# Altium project AMC_FMC_Carrier v4.PrjPcb (part 7 of 18)

## Sheet SDRAM.SchDoc: AMC FMC Carrier v4
size 420 x 297 mm; CompanyName: WUT; Organization: WUT ISE; Address1: Warsaw Univeristy of Technology; Address2: Nowowiejska 15/19 00-665 Warsaw; Address3: t.przywozki@gmail.com; Revision: 1; SheetNumber: 17; SheetTotal: 29; Project: AMC FMC Carrier v4; ModifiedBy: -; CheckedDate: -; Title2: DDR3 32bit; DivGrp: ISE; Designer: T. Przywozki; ModifiedDate: -; ProjectName: ADC/DAC MEZZANINE
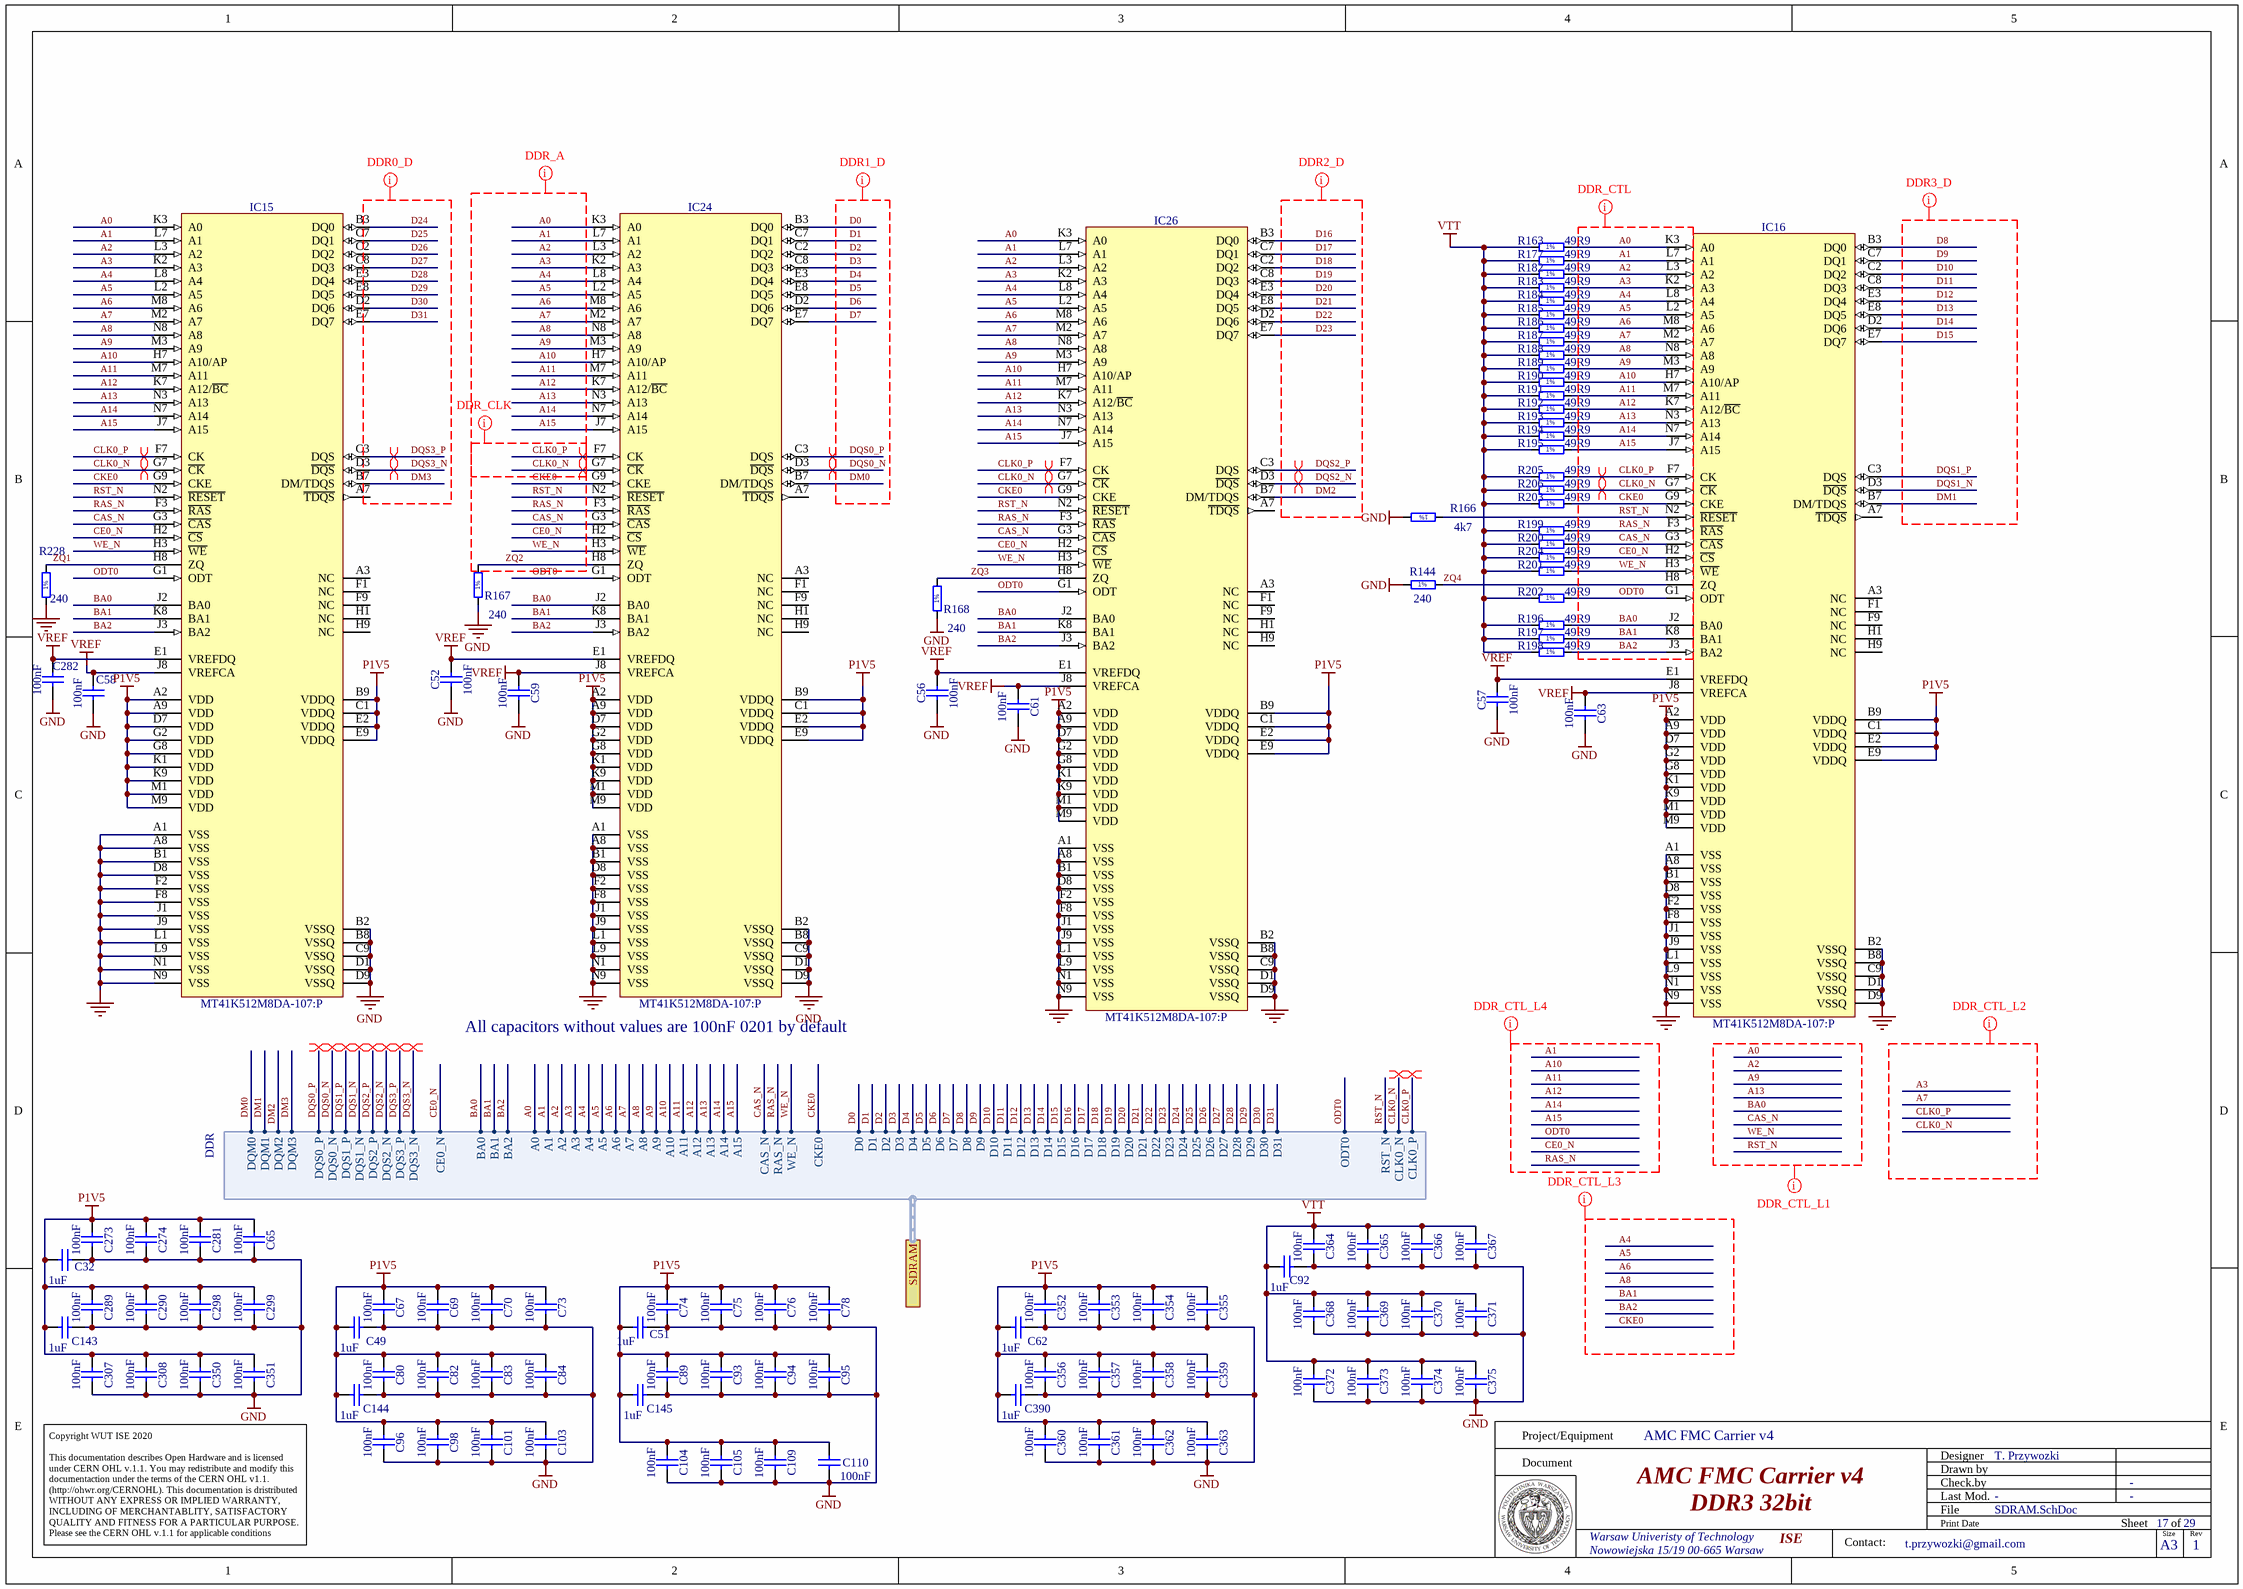
[diagram p12: SDRAM.SchDoc]

### Parts
C32  1uF  [CAPC1608X87N]
C49  1uF  [CAPC1608X87N]
C51  1uF  [CAPC1608X87N]
C52  100nF  [CAPC0603X33N]
C56  100nF  [CAPC0603X33N]
C57  100nF  [CAPC0603X33N]
C58  100nF  [CAPC0603X33N]
C59  100nF  [CAPC0603X33N]
C61  100nF  [CAPC0603X33N]
C62  1uF  [CAPC1608X87N]
C63  100nF  [CAPC0603X33N]
C65  100nF  [CAPC0603X33N]
C67  100nF  [CAPC0603X33N]
C69  100nF  [CAPC0603X33N]
C70  100nF  [CAPC0603X33N]
C73  100nF  [CAPC0603X33N]
C74  100nF  [CAPC0603X33N]
C75  100nF  [CAPC0603X33N]
C76  100nF  [CAPC0603X33N]
C78  100nF  [CAPC0603X33N]
C80  100nF  [CAPC0603X33N]
C82  100nF  [CAPC0603X33N]
C83  100nF  [CAPC0603X33N]
C84  100nF  [CAPC0603X33N]
C89  100nF  [CAPC0603X33N]
C92  1uF  [CAPC1608X87N]
C93  100nF  [CAPC0603X33N]
C94  100nF  [CAPC0603X33N]
C95  100nF  [CAPC0603X33N]
C96  100nF  [CAPC0603X33N]
C98  100nF  [CAPC0603X33N]
C101  100nF  [CAPC0603X33N]
C103  100nF  [CAPC0603X33N]
C104  100nF  [CAPC0603X33N]
C105  100nF  [CAPC0603X33N]
C109  100nF  [CAPC0603X33N]
C110  100nF  [CAPC0603X33N]
C143  1uF  [CAPC1608X87N]
C144  1uF  [CAPC1608X87N]
C145  1uF  [CAPC1608X87N]
C273  100nF  [CAPC0603X33N]
C274  100nF  [CAPC0603X33N]
C281  100nF  [CAPC0603X33N]
C282  100nF  [CAPC0603X33N]
C289  100nF  [CAPC0603X33N]
C290  100nF  [CAPC0603X33N]
C298  100nF  [CAPC0603X33N]
C299  100nF  [CAPC0603X33N]
C307  100nF  [CAPC0603X33N]
C308  100nF  [CAPC0603X33N]
C350  100nF  [CAPC0603X33N]
C351  100nF  [CAPC0603X33N]
C352  100nF  [CAPC0603X33N]
C353  100nF  [CAPC0603X33N]
C354  100nF  [CAPC0603X33N]
C355  100nF  [CAPC0603X33N]
C356  100nF  [CAPC0603X33N]
C357  100nF  [CAPC0603X33N]
C358  100nF  [CAPC0603X33N]
C359  100nF  [CAPC0603X33N]
C360  100nF  [CAPC0603X33N]
C361  100nF  [CAPC0603X33N]
C362  100nF  [CAPC0603X33N]
C363  100nF  [CAPC0603X33N]
C364  100nF  [CAPC0603X33N]
C365  100nF  [CAPC0603X33N]
C366  100nF  [CAPC0603X33N]
C367  100nF  [CAPC0603X33N]
C368  100nF  [CAPC0603X33N]
C369  100nF  [CAPC0603X33N]
C370  100nF  [CAPC0603X33N]
C371  100nF  [CAPC0603X33N]
C372  100nF  [CAPC0603X33N]
C373  100nF  [CAPC0603X33N]
C374  100nF  [CAPC0603X33N]
C375  100nF  [CAPC0603X33N]
C390  1uF  [CAPC1608X87N]
IC15  MT41K512M8DA-107:P  [BGA78C80P9X13_800X1050X120]
IC16  MT41K512M8DA-107:P  [BGA78C80P9X13_800X1050X120]
IC24  MT41K512M8DA-107:P  [BGA78C80P9X13_800X1050X120]
IC26  MT41K512M8DA-107:P  [BGA78C80P9X13_800X1050X120]
R144  240  [RESC1005X40N]
R163  49R9  [RESC1005X40N]
R166  4k7  [RESC1005X40N]
R167  240  [RESC1005X40N]
R168  240  [RESC1005X40N]
R177  49R9  [RESC1005X40N]
R182  49R9  [RESC1005X40N]
R183  49R9  [RESC1005X40N]
R184  49R9  [RESC1005X40N]
R185  49R9  [RESC1005X40N]
R186  49R9  [RESC1005X40N]
R187  49R9  [RESC1005X40N]
R188  49R9  [RESC1005X40N]
R189  49R9  [RESC1005X40N]
R190  49R9  [RESC1005X40N]
R191  49R9  [RESC1005X40N]
R192  49R9  [RESC1005X40N]
R193  49R9  [RESC1005X40N]
R194  49R9  [RESC1005X40N]
R195  49R9  [RESC1005X40N]
R196  49R9  [RESC1005X40N]
R197  49R9  [RESC1005X40N]
R198  49R9  [RESC1005X40N]
R199  49R9  [RESC1005X40N]
R200  49R9  [RESC1005X40N]
R201  49R9  [RESC1005X40N]
R202  49R9  [RESC1005X40N]
R203  49R9  [RESC1005X40N]
R204  49R9  [RESC1005X40N]
R205  49R9  [RESC1005X40N]
R206  49R9  [RESC1005X40N]
R228  240  [RESC1005X40N]

### Ports
SDRAM (harness DDR)

### Harnesses
DDR: CKE0, A0, A1, A2, A3, A4, A5, A7, A8, A9, A10, A11, A12, A13, BA0, BA1, BA2, A14, A15, CAS_N, RAS_N, WE_N, CE0_N, DQM0, DQM1, A6, D0, D1, D2, D3, D4, D5, D6, D7, D8, D9, D10, D11, D12, D13, D14, D15, CLK0_N, CLK0_P, ODT0, RST_N, D16, D17, D18, D19, D20, D21, D22, D23, D24, D25, D26, D27, D28, D29, D30, D31, DQS0_P, DQS1_P, DQS0_N, DQS1_N, DQS3_N, DQS3_P, DQS2_P, DQS2_N, DQM2, DQM3

### Nets
GND: C32.2 C49.2 C51.2 C52.2 C56.2 C57.2 C58.2 C59.2 C61.2 C62.2 C63.2 C65.2 C67.2 C69.2 C70.2 C73.2 C74.2 C75.2 C76.2 C78.2 C80.2 C82.2 C83.2 C84.2 C89.2 C92.2 C93.2 C94.2 C95.2 C96.2 C98.2 C101.2 C103.2 C104.2 C105.2 C109.2 C110.1 C143.2 C144.2 C145.2 C273.2 C274.2 C281.2 C282.1 C289.2 C290.2 C298.2 C299.2 C307.2 C308.2 C350.2 C351.2 C352.2 C353.2 C354.2 C355.2 C356.2 C357.2 C358.2 C359.2 C360.2 C361.2 C362.2 C363.2 C364.2 C365.2 C366.2 C367.2 C368.2 C369.2 C370.2 C371.2 C372.2 C373.2 C374.2 C375.2 C390.2 IC15.A1(VSS) IC15.A8(VSS) IC15.B1(VSS) IC15.B2(VSSQ) IC15.B8(VSSQ) IC15.C9(VSSQ) IC15.D1(VSSQ) IC15.D8(VSS) IC15.D9(VSSQ) IC15.F2(VSS) IC15.F8(VSS) IC15.J1(VSS) IC15.J9(VSS) IC15.L1(VSS) IC15.L9(VSS) IC15.N1(VSS) IC15.N9(VSS) IC16.A1(VSS) IC16.A8(VSS) IC16.B1(VSS) IC16.B2(VSSQ) IC16.B8(VSSQ) IC16.C9(VSSQ) IC16.D1(VSSQ) IC16.D8(VSS) IC16.D9(VSSQ) IC16.F2(VSS) IC16.F8(VSS) IC16.J1(VSS) IC16.J9(VSS) IC16.L1(VSS) IC16.L9(VSS) IC16.N1(VSS) IC16.N9(VSS) IC24.A1(VSS) IC24.A8(VSS) IC24.B1(VSS) IC24.B2(VSSQ) IC24.B8(VSSQ) IC24.C9(VSSQ) IC24.D1(VSSQ) IC24.D8(VSS) IC24.D9(VSSQ) IC24.F2(VSS) IC24.F8(VSS) IC24.J1(VSS) IC24.J9(VSS) IC24.L1(VSS) IC24.L9(VSS) IC24.N1(VSS) IC24.N9(VSS) IC26.A1(VSS) IC26.A8(VSS) IC26.B1(VSS) IC26.B2(VSSQ) IC26.B8(VSSQ) IC26.C9(VSSQ) IC26.D1(VSSQ) IC26.D8(VSS) IC26.D9(VSSQ) IC26.F2(VSS) IC26.F8(VSS) IC26.J1(VSS) IC26.J9(VSS) IC26.L1(VSS) IC26.L9(VSS) IC26.N1(VSS) IC26.N9(VSS) R144.1 R166.2 R167.1 R168.1 R228.1
P1V5: C32.1 C49.1 C51.1 C62.1 C65.1 C67.1 C69.1 C70.1 C73.1 C74.1 C75.1 C76.1 C78.1 C80.1 C82.1 C83.1 C84.1 C89.1 C93.1 C94.1 C95.1 C96.1 C98.1 C101.1 C103.1 C104.1 C105.1 C109.1 C110.2 C143.1 C144.1 C145.1 C273.1 C274.1 C281.1 C289.1 C290.1 C298.1 C299.1 C307.1 C308.1 C350.1 C351.1 C352.1 C353.1 C354.1 C355.1 C356.1 C357.1 C358.1 C359.1 C360.1 C361.1 C362.1 C363.1 C390.1 IC15.A2(VDD) IC15.A9(VDD) IC15.B9(VDDQ) IC15.C1(VDDQ) IC15.D7(VDD) IC15.E2(VDDQ) IC15.E9(VDDQ) IC15.G2(VDD) IC15.G8(VDD) IC15.K1(VDD) IC15.K9(VDD) IC15.M1(VDD) IC15.M9(VDD) IC16.A2(VDD) IC16.A9(VDD) IC16.B9(VDDQ) IC16.C1(VDDQ) IC16.D7(VDD) IC16.E2(VDDQ) IC16.E9(VDDQ) IC16.G2(VDD) IC16.G8(VDD) IC16.K1(VDD) IC16.K9(VDD) IC16.M1(VDD) IC16.M9(VDD) IC24.A2(VDD) IC24.A9(VDD) IC24.B9(VDDQ) IC24.C1(VDDQ) IC24.D7(VDD) IC24.E2(VDDQ) IC24.E9(VDDQ) IC24.G2(VDD) IC24.G8(VDD) IC24.K1(VDD) IC24.K9(VDD) IC24.M1(VDD) IC24.M9(VDD) IC26.A2(VDD) IC26.A9(VDD) IC26.B9(VDDQ) IC26.C1(VDDQ) IC26.D7(VDD) IC26.E2(VDDQ) IC26.E9(VDDQ) IC26.G2(VDD) IC26.G8(VDD) IC26.K1(VDD) IC26.K9(VDD) IC26.M1(VDD) IC26.M9(VDD)
VREF: C52.1 C56.1 C57.1 C58.1 C59.1 C61.1 C63.1 C282.2 IC15.E1(VREFDQ) IC15.J8(VREFCA) IC16.E1(VREFDQ) IC16.J8(VREFCA) IC24.E1(VREFDQ) IC24.J8(VREFCA) IC26.E1(VREFDQ) IC26.J8(VREFCA)
VTT: C92.1 C364.1 C365.1 C366.1 C367.1 C368.1 C369.1 C370.1 C371.1 C372.1 C373.1 C374.1 C375.1 R163.1 R177.1 R182.1 R183.1 R184.1 R185.1 R186.1 R187.1 R188.1 R189.1 R190.1 R191.1 R192.1 R193.1 R194.1 R195.1 R196.1 R197.1 R198.1 R199.1 R200.1 R201.1 R202.1 R203.1 R204.1 R205.1 R206.1
A0: IC15.K3(A0) IC16.K3(A0) IC24.K3(A0) IC26.K3(A0) R163.2 ; port SDRAM.A0  [project net FDDR.A0]
A1: IC15.L7(A1) IC16.L7(A1) IC24.L7(A1) IC26.L7(A1) R177.2 ; port SDRAM.A1  [project net FDDR.A1]
A2: IC15.L3(A2) IC16.L3(A2) IC24.L3(A2) IC26.L3(A2) R182.2 ; port SDRAM.A2  [project net FDDR.A2]
A3: IC15.K2(A3) IC16.K2(A3) IC24.K2(A3) IC26.K2(A3) R183.2 ; port SDRAM.A3  [project net FDDR.A3]
A4: IC15.L8(A4) IC16.L8(A4) IC24.L8(A4) IC26.L8(A4) R184.2 ; port SDRAM.A4  [project net FDDR.A4]
A5: IC15.L2(A5) IC16.L2(A5) IC24.L2(A5) IC26.L2(A5) R185.2 ; port SDRAM.A5  [project net FDDR.A5]
A6: IC15.M8(A6) IC16.M8(A6) IC24.M8(A6) IC26.M8(A6) R186.2 ; port SDRAM.A6  [project net FDDR.A6]
A7: IC15.M2(A7) IC16.M2(A7) IC24.M2(A7) IC26.M2(A7) R187.2 ; port SDRAM.A7  [project net FDDR.A7]
A8: IC15.N8(A8) IC16.N8(A8) IC24.N8(A8) IC26.N8(A8) R188.2 ; port SDRAM.A8  [project net FDDR.A8]
A9: IC15.M3(A9) IC16.M3(A9) IC24.M3(A9) IC26.M3(A9) R189.2 ; port SDRAM.A9  [project net FDDR.A9]
A10: IC15.H7(A10/AP) IC16.H7(A10/AP) IC24.H7(A10/AP) IC26.H7(A10/AP) R190.2 ; port SDRAM.A10  [project net FDDR.A10]
A11: IC15.M7(A11) IC16.M7(A11) IC24.M7(A11) IC26.M7(A11) R191.2 ; port SDRAM.A11  [project net FDDR.A11]
A12: IC15.K7(A12/~{BC}) IC16.K7(A12/~{BC}) IC24.K7(A12/~{BC}) IC26.K7(A12/~{BC}) R192.2 ; port SDRAM.A12  [project net FDDR.A12]
A13: IC15.N3(A13) IC16.N3(A13) IC24.N3(A13) IC26.N3(A13) R193.2 ; port SDRAM.A13  [project net FDDR.A13]
A14: IC15.N7(A14) IC16.N7(A14) IC24.N7(A14) IC26.N7(A14) R194.2 ; port SDRAM.A14  [project net FDDR.A14]
A15: IC15.J7(A15) IC16.J7(A15) IC24.J7(A15) IC26.J7(A15) R195.2 ; port SDRAM.A15  [project net FDDR.A15]
BA0: IC15.J2(BA0) IC16.J2(BA0) IC24.J2(BA0) IC26.J2(BA0) R196.2 ; port SDRAM.BA0  [project net FDDR.BA0]
BA1: IC15.K8(BA1) IC16.K8(BA1) IC24.K8(BA1) IC26.K8(BA1) R197.2 ; port SDRAM.BA1  [project net FDDR.BA1]
BA2: IC15.J3(BA2) IC16.J3(BA2) IC24.J3(BA2) IC26.J3(BA2) R198.2 ; port SDRAM.BA2  [project net FDDR.BA2]
CAS_N: IC15.G3(~{CAS}) IC16.G3(~{CAS}) IC24.G3(~{CAS}) IC26.G3(~{CAS}) R200.2 ; port SDRAM.CAS_N  [project net FDDR.CAS_N]
CE0_N: IC15.H2(~{CS}) IC16.H2(~{CS}) IC24.H2(~{CS}) IC26.H2(~{CS}) R204.2 ; port SDRAM.CE0_N  [project net FDDR.CE0_N]
CKE0: IC15.G9(CKE) IC16.G9(CKE) IC24.G9(CKE) IC26.G9(CKE) R203.2 ; port SDRAM.CKE0  [project net FDDR.CKE0]
CLK0_N: IC15.G7(~{CK}) IC16.G7(~{CK}) IC24.G7(~{CK}) IC26.G7(~{CK}) R206.2 ; port SDRAM.CLK0_N  [project net FDDR.CLK0_N]
CLK0_P: IC15.F7(CK) IC16.F7(CK) IC24.F7(CK) IC26.F7(CK) R205.2 ; port SDRAM.CLK0_P  [project net FDDR.CLK0_P]
D0: IC24.B3(DQ0) ; port SDRAM.D0  [project net FDDR.D0]
D1: IC24.C7(DQ1) ; port SDRAM.D1  [project net FDDR.D1]
D2: IC24.C2(DQ2) ; port SDRAM.D2  [project net FDDR.D2]
D3: IC24.C8(DQ3) ; port SDRAM.D3  [project net FDDR.D3]
D4: IC24.E3(DQ4) ; port SDRAM.D4  [project net FDDR.D4]
D5: IC24.E8(DQ5) ; port SDRAM.D5  [project net FDDR.D5]
D6: IC24.D2(DQ6) ; port SDRAM.D6  [project net FDDR.D6]
D7: IC24.E7(DQ7) ; port SDRAM.D7  [project net FDDR.D7]
D8: IC16.B3(DQ0) ; port SDRAM.D8  [project net FDDR.D8]
D9: IC16.C7(DQ1) ; port SDRAM.D9  [project net FDDR.D9]
D10: IC16.C2(DQ2) ; port SDRAM.D10  [project net FDDR.D10]
D11: IC16.C8(DQ3) ; port SDRAM.D11  [project net FDDR.D11]
D12: IC16.E3(DQ4) ; port SDRAM.D12  [project net FDDR.D12]
D13: IC16.E8(DQ5) ; port SDRAM.D13  [project net FDDR.D13]
D14: IC16.D2(DQ6) ; port SDRAM.D14  [project net FDDR.D14]
D15: IC16.E7(DQ7) ; port SDRAM.D15  [project net FDDR.D15]
D16: IC26.B3(DQ0) ; port SDRAM.D16  [project net FDDR.D16]
D17: IC26.C7(DQ1) ; port SDRAM.D17  [project net FDDR.D17]
D18: IC26.C2(DQ2) ; port SDRAM.D18  [project net FDDR.D18]
D19: IC26.C8(DQ3) ; port SDRAM.D19  [project net FDDR.D19]
D20: IC26.E3(DQ4) ; port SDRAM.D20  [project net FDDR.D20]
D21: IC26.E8(DQ5) ; port SDRAM.D21  [project net FDDR.D21]
D22: IC26.D2(DQ6) ; port SDRAM.D22  [project net FDDR.D22]
D23: IC26.E7(DQ7) ; port SDRAM.D23  [project net FDDR.D23]
D24: IC15.B3(DQ0) ; port SDRAM.D24  [project net FDDR.D24]
D25: IC15.C7(DQ1) ; port SDRAM.D25  [project net FDDR.D25]
D26: IC15.C2(DQ2) ; port SDRAM.D26  [project net FDDR.D26]
D27: IC15.C8(DQ3) ; port SDRAM.D27  [project net FDDR.D27]
D28: IC15.E3(DQ4) ; port SDRAM.D28  [project net FDDR.D28]
D29: IC15.E8(DQ5) ; port SDRAM.D29  [project net FDDR.D29]
D30: IC15.D2(DQ6) ; port SDRAM.D30  [project net FDDR.D30]
D31: IC15.E7(DQ7) ; port SDRAM.D31  [project net FDDR.D31]
DM0: IC24.B7(DM/TDQS) ; port SDRAM.DQM0  [project net FDDR.DQM0]
DM1: IC16.B7(DM/TDQS) ; port SDRAM.DQM1  [project net FDDR.DQM1]
DM2: IC26.B7(DM/TDQS) ; port SDRAM.DQM2  [project net FDDR.DQM2]
DM3: IC15.B7(DM/TDQS) ; port SDRAM.DQM3  [project net FDDR.DQM3]
DQS0_N: IC24.D3(~{DQS}) ; port SDRAM.DQS0_N  [project net FDDR.DQS0_N]
DQS0_P: IC24.C3(DQS) ; port SDRAM.DQS0_P  [project net FDDR.DQS0_P]
DQS1_N: IC16.D3(~{DQS}) ; port SDRAM.DQS1_N  [project net FDDR.DQS1_N]
DQS1_P: IC16.C3(DQS) ; port SDRAM.DQS1_P  [project net FDDR.DQS1_P]
DQS2_N: IC26.D3(~{DQS}) ; port SDRAM.DQS2_N  [project net FDDR.DQS2_N]
DQS2_P: IC26.C3(DQS) ; port SDRAM.DQS2_P  [project net FDDR.DQS2_P]
DQS3_N: IC15.D3(~{DQS}) ; port SDRAM.DQS3_N  [project net FDDR.DQS3_N]
DQS3_P: IC15.C3(DQS) ; port SDRAM.DQS3_P  [project net FDDR.DQS3_P]
ODT0: IC15.G1(ODT) IC16.G1(ODT) IC24.G1(ODT) IC26.G1(ODT) R202.2 ; port SDRAM.ODT0  [project net FDDR.ODT0]
RAS_N: IC15.F3(~{RAS}) IC16.F3(~{RAS}) IC24.F3(~{RAS}) IC26.F3(~{RAS}) R199.2 ; port SDRAM.RAS_N  [project net FDDR.RAS_N]
RST_N: IC15.N2(~{RESET}) IC16.N2(~{RESET}) IC24.N2(~{RESET}) IC26.N2(~{RESET}) R166.1 ; port SDRAM.RST_N  [project net FDDR.RST_N]
WE_N: IC15.H3(~{WE}) IC16.H3(~{WE}) IC24.H3(~{WE}) IC26.H3(~{WE}) R201.2 ; port SDRAM.WE_N  [project net FDDR.WE_N]
ZQ1: IC15.H8(ZQ) R228.2
ZQ2: IC24.H8(ZQ) R167.2
ZQ3: IC26.H8(ZQ) R168.2
ZQ4: IC16.H8(ZQ) R144.2

Not connected (* = marked no-connect by the designer): IC15 A3(NC) A7(~{TDQS}) F1(NC) F9(NC) H1(NC) H9(NC); IC16 A3(NC) A7(~{TDQS}) F1(NC) F9(NC) H1(NC) H9(NC); IC24 A3(NC) A7(~{TDQS}) F1(NC) F9(NC) H1(NC) H9(NC); IC26 A3(NC) A7(~{TDQS}) F1(NC) F9(NC) H1(NC) H9(NC)

### Layout directives
differential pair: FDDR.CLK0_N, FDDR.CLK0_P, FDDR.DQS0_N, FDDR.DQS0_P, FDDR.DQS1_N, FDDR.DQS1_P, FDDR.DQS2_N, FDDR.DQS2_P, FDDR.DQS3_N, FDDR.DQS3_P
net class DDR1_D: D0, D1, D2, D3, D4, D5, D6, D7, DM0, DQS0_N, DQS0_P
net class DDR_A: A0, A1, A2, A3, A4, A5, A6, A7, A8, A9, A10, A11, A12, A13, A14, A15, CAS_N, CE0_N, CKE0, CLK0_N, CLK0_P, RAS_N, RST_N, WE_N, ZQ2
net class DDR0_D: D24, D25, D26, D27, D28, D29, D30, D31, DM3, DQS3_N, DQS3_P
net class DDR2_D: D16, D17, D18, D19, D20, D21, D22, D23, DM2, DQS2_N, DQS2_P
net class DDR3_D: D8, D9, D10, D11, D12, D13, D14, D15, DM1, DQS1_N, DQS1_P
net class DDR_CLK: CLK0_N, CLK0_P
net class DDR_CTL: A0, A1, A2, A3, A4, A5, A6, A7, A8, A9, A10, A11, A12, A13, A14, A15, BA0, BA1, BA2, CAS_N, CE0_N, CKE0, CLK0_N, CLK0_P, ODT0, RAS_N, RST_N, WE_N
net class DDR_CTL_L4: A1, A10, A11, A12, A14, A15, CE0_N, ODT0, RAS_N
net class DDR_CTL_L1: A0, A2, A9, A13, BA0, CAS_N, RST_N, WE_N
net class DDR_CTL_L2: A3, A7, CLK0_N, CLK0_P
net class DDR_CTL_L3: A4, A5, A6, A8, BA1, BA2, CKE0

### Notes on the sheet
- (near IC24) All capacitors without values are 100nF 0201 by default
- Project/Equipment
- Document
- Designer
- Drawn by
- Check.by
- Copyright WUT ISE 2020
  This documentation describes Open Hardware and is licensed under CERN OHL v.1.1. You may redistribute and modify this documentaction under the terms of the CERN OHL v1.1.
  (http://ohwr.org/CERNOHL). This documentation is dristributed WITHOUT ANY EXPRESS OR IMPLIED WARRANTY, INCLUDING OF MERCHANTABLITY, SATISFACTORY QUALITY AND FITNESS FOR A PARTICULAR PURPOSE. Please see the CERN OHL v.1.1 for applicable conditions
- File
- Last Mod.
- Print Date
- Sheet
- Size
- A3
- of
- Rev
- Contact:
- (in symbol R0402_4K7_1%_0.0625W_100PPM) 1%
- (in symbol R0402_43R_1%_0.0625W_100PPM) 1%
- (in symbol R0402_240R_1%_0.0625W_100PPM) 1%

### Library data of the parts
C32 C49 C51 C62 C92 C143-C145 C390 = CC0603_1UF_16V_10%_X7R: Non-polarised capacitor; Part Description: SMD Multilayer Chip Ceramic Capacitor; Manufacturer: GENERIC; Manufacturer1 Part Number: 223824613663; Voltage: 16V; TC: X7R; Tolerance: ±10%; Table: Capacitors SMD; Part Number: CC0603_1UF_16V_10%_X7R; Component Kind: Standard; Component Type: Standard; Pin Count: 2; Value: 1uF; Status: Preferred; Manufacturer Part Number: CC0603_1uF_16V_10%_X7R; Case: 0603; Mounted: Yes; Socket: No; SMD: Yes; Manufacturer1 Example: PHYCOMP; Manufacturer1 ComponentHeight: 0.87mm; HelpURL: \\cern.ch\dfs\Applications\Altium\Datasheets\CC0805_X5R_PHYCOMP_HC.pdf; Author: CERN DEM JLC; CreateDate: 2007-12-03; LatestRevisionDate: 2007-12-03
C52 C56-C59 C61 C63 C65 C67 C69 C70 C73-C76 C78 C80 C82-C84 C89 C93-C96 C98 C101 C103-C105 C109 C110 C273 C274 C281 C282 C289 C290 C298 C299 C307 C308 C350-C375 = CC0201_100NF_6.3V_10%_X5R: as C255-C258 on sheet FPGA_SUP; Part Number: CC0201_100NF_6.3V_10%_X5R; Component Kind: Standard; Component Type: Standard; Pin Count: 2; Value: 100nF; Status: Not Recommended; Manufacturer Part Number: CC0201_100NF_6.3V_10%_X5R; Case: 0201; Mounted: Yes; Socket: No; SMD: Yes; Manufacturer1 Example: AVX; Manufacturer1 ComponentHeight: 0.33mm; HelpURL: \\cern.ch\dfs\Applications\Altium\Datasheets\CC0201_X5R_AVX.pdf; Author: CERN DEM JLC; CreateDate: 2007-12-03; LatestRevisionDate: 2007-12-03
IC15 IC16 IC24 IC26 = MT41K512M8DA-107:P: 1.35V, 4Gb (512 Meg x 8) DDR3L SDRAM; Manufacturer: MICRON TECHNOLOGY; PressFit: No; Bonding: No; Part Number: MT41K512M8DA-107:P; Component Kind: Standard; Component Type: Standard; Device: MT41K512M8DA-107:P; PackageDescription: BGA, 0.80mm Pitch, Rect.; 78 Pin, 9 Columns X 13 Rows, 8.00mm X 10.50mm X 1.20mm H; Part Description: 1.35V, 4Gb (512 Meg x 8) DDR3L SDRAM; Manufacturer Part Number: MT41K512M8DA-107:P; Pin Count: 78; Case: BGA78; Mounted: Yes; Socket: No; SMD: Yes; Sense: No; ComponentHeight: 1.2mm; HelpURL: \\cern.ch\dfs\Applications\Altium\Datasheets\MT41K512M8DA-107-P.pdf; Author: CERN DEM JLC; CreateDate: 16.11.2016; LatestRevisionDate: 16.11.2016
R144 R167 R168 R228 = R0402_240R_1%_0.0625W_100PPM: Resistor - 1%; Part Description: General Purpose Thick Film Chip Resistor; Manufacturer: GENERIC; Manufacturer1 Part Number: 232270672401L; TC: ±100ppm/°C; Table: Resistors SMD; Part Number: R0402_240R_1%_0.0625W_100PPM; Component Kind: Standard; Component Type: Standard; Pin Count: 2; Value: 240; Status: Not recommended; Power: 0.0625W; Tolerance: ±1%; Manufacturer Part Number: R0402_240R_1%_0.0625W_100PPM; Case: 0402; Mounted: Yes; Socket: No; SMD: Yes; Manufacturer1 Example: YAGEO PHYCOMP; Manufacturer1 ComponentHeight: 0.4mm; HelpURL: \\cern.ch\dfs\Applications\Altium\Datasheets\R0402_Phycomp_RC0402.pdf; Author: CERN DEM JLC; CreateDate: 2007-12-03; LatestRevisionDate: 2012-10-17
R163 R177 R182-R206 = R0402_43R_1%_0.0625W_100PPM: Resistor - 1%; Part Number: R0402_49R9_1%_0.0625W_100PPM; Part Description: General Purpose Thick Film Chip Resistor; Manufacturer: GENERIC; Manufacturer1 Part Number: 232270674309; TC: ±100ppm/°C; Table: Resistors SMD; Component Kind: Standard; Component Type: Standard; Pin Count: 2; Value: 49R9; Status: Not recommended; Power: 0.0625W; Tolerance: ±1%; Manufacturer Part Number: R0402_49R9_1%_0.0625W_100PPM; Case: 0402; Mounted: Yes; Socket: No; SMD: Yes; Manufacturer1 Example: PHYCOMP; Manufacturer1 ComponentHeight: 0.4mm; HelpURL: \\cern.ch\dfs\Applications\Altium\Datasheets\R0402_Phycomp_RC0402.pdf; Author: CERN DEM JLC; CreateDate: 2007-12-03; LatestRevisionDate: 2008-03-13
R166 = R0402_4K7_1%_0.0625W_100PPM: Resistor - 1%; Part Description: General Purpose Thick Film Chip Resistor; Manufacturer: GENERIC; Manufacturer1 Part Number: 232270674702L; TC: ±100ppm/°C; Table: Resistors SMD; Part Number: R0402_4K7_1%_0.0625W_100PPM; Component Kind: Standard; Component Type: Standard; Pin Count: 2; Value: 4k7; Status: Not recommended; Power: 0.0625W; Tolerance: ±1%; Manufacturer Part Number: R0402_4K7_1%_0.0625W_100PPM; Case: 0402; Mounted: Yes; Socket: No; SMD: Yes; Manufacturer1 Example: YAGEO PHYCOMP; Manufacturer1 ComponentHeight: 0.4mm; HelpURL: \\cern.ch\dfs\Applications\Altium\Datasheets\R0402_Phycomp_RC0402.pdf; Author: CERN DEM JLC; CreateDate: 2007-12-03; LatestRevisionDate: 2012-10-17